# EAGLE design PIC28 (EAGLE 5.12)
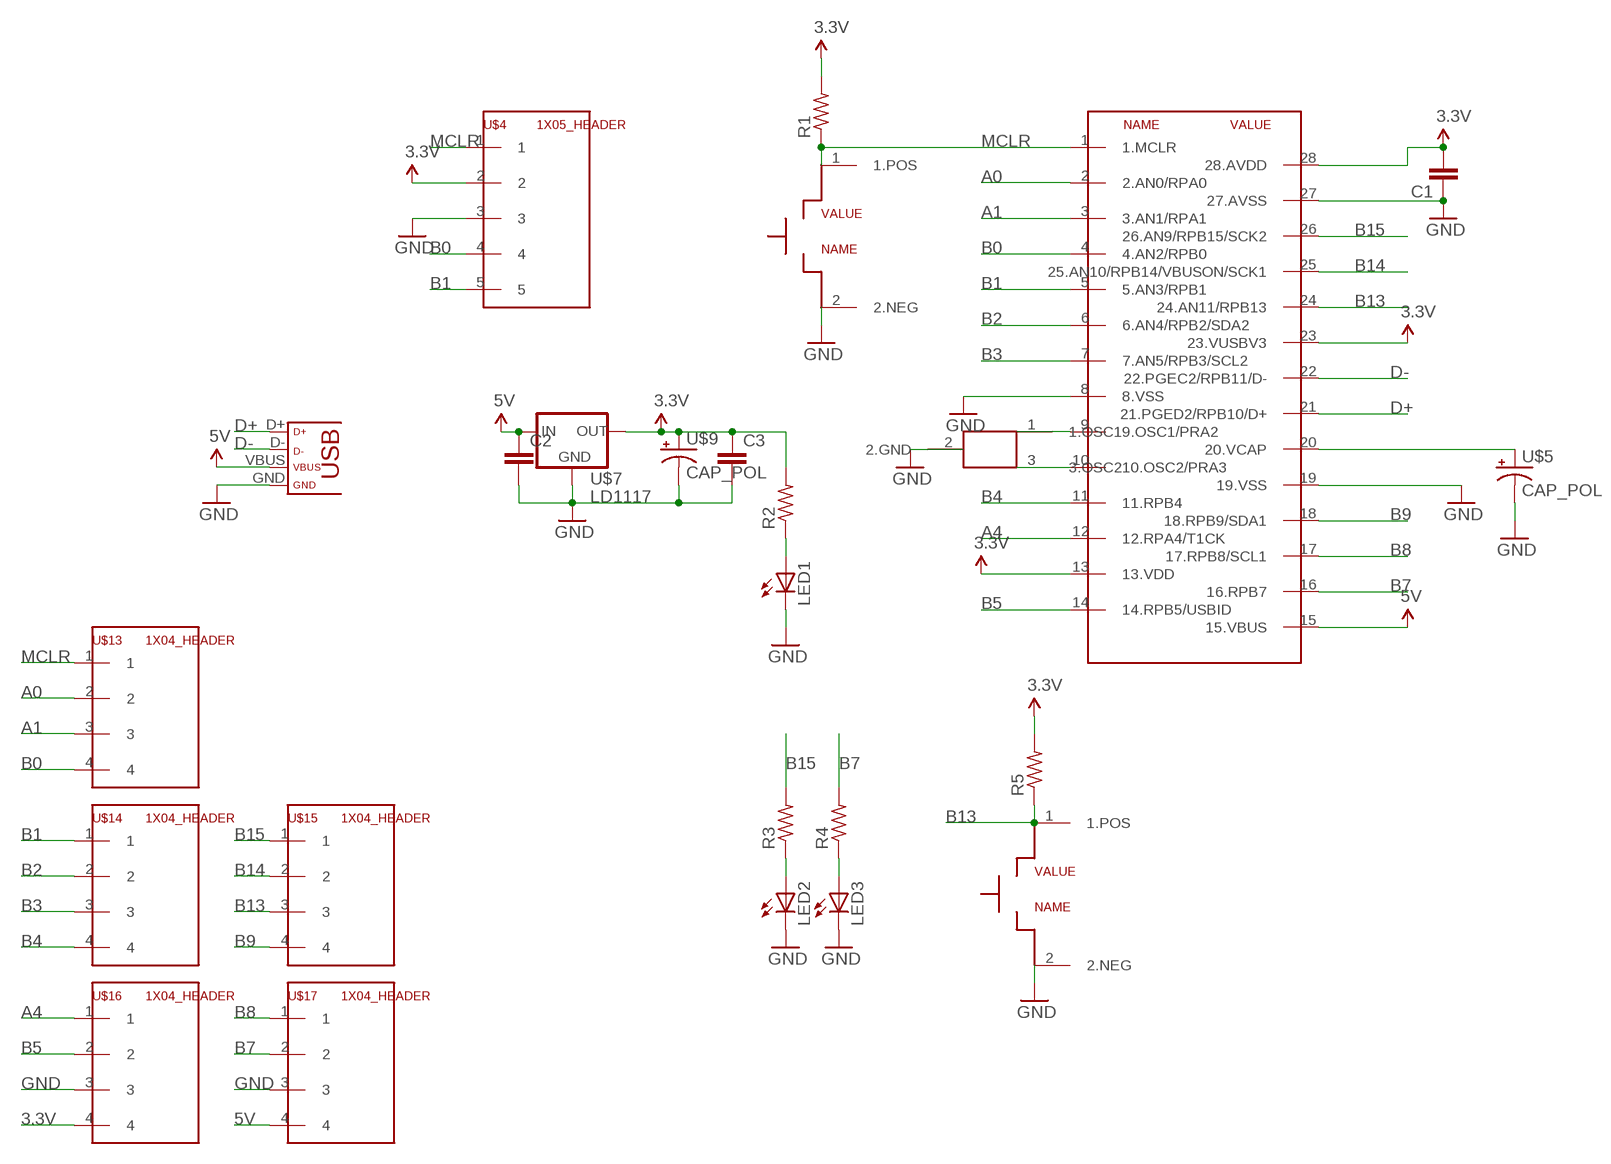
[diagram p0: schematic, sheet 1]

## Parts
C1  C-EU025-025X050  [C025-025X050]
C2  C-EU025-025X050  [C025-025X050]
C3  C-EU025-025X050  [C025-025X050]
LED1  LED3MM  [LED3MM]
LED2  LED3MM  [LED3MM]
LED3  LED3MM  [LED3MM]
R1  R-US_0309/12  [0309/12]
R2  R-US_0309/12  [0309/12]
R3  R-US_0309/12  [0309/12]
R4  R-US_0309/12  [0309/12]
R5  R-US_0309/12  [0309/12]
U$1  PIC28  [DIL28-3]
U$2  BUTTON  [BUTTON]
U$3  RESONATOR  [1X03]
U$4  1X05_HEADER  [1X05]
U$5  CAP_POL  [CAP_POL_D]
U$7  LD1117  [TO220]
U$9  CAP_POL  [CAP_POL_D]
U$10  USB  [USB-MINIB]
U$12  BUTTON  [BUTTON]
U$13  1X04_HEADER  [1X04]
U$14  1X04_HEADER  [1X04]
U$15  1X04_HEADER  [1X04]
U$16  1X04_HEADER  [1X04]
U$17  1X04_HEADER  [1X04]

## Nets
3.3V: C1.2 C3.1 R1.2 R2.2 R5.2 U$1.13(13.VDD) U$1.23(23.VUSBV3) U$1.28(28.AVDD) U$4.2 U$7.2(OUT) U$9.1(+) U$16.4
5V: C2.1 U$1.15(15.VBUS) U$7.3(IN) U$10.VBUS U$17.4
A0: U$1.2(2.AN0/RPA0) U$13.2
A1: U$1.3(3.AN1/RPA1) U$13.3
A4: U$1.12(12.RPA4/T1CK) U$16.1
B0: U$1.4(4.AN2/RPB0) U$4.4 U$13.4
B1: U$1.5(5.AN3/RPB1) U$4.5 U$14.1
B2: U$1.6(6.AN4/RPB2/SDA2) U$14.2
B3: U$1.7(7.AN5/RPB3/SCL2) U$14.3
B4: U$1.11(11.RPB4) U$14.4
B5: U$1.14(14.RPB5/USBID) U$16.2
B7: R4.2 U$1.16(16.RPB7) U$17.2
B8: U$1.17(17.RPB8/SCL1) U$17.1
B9: U$1.18(18.RPB9/SDA1) U$15.4
B13: R5.1 U$1.24(24.AN11/RPB13) U$12.1(1.POS) U$15.3
B14: U$1.25(25.AN10/RPB14/VBUSON/SCK1) U$15.2
B15: R3.2 U$1.26(26.AN9/RPB15/SCK2) U$15.1
D+: U$1.21(21.PGED2/RPB10/D+) U$10.D+
D-: U$1.22(22.PGEC2/RPB11/D-) U$10.D-
GND: C1.1 C2.2 C3.2 LED1.K(C) LED2.K(C) LED3.K(C) U$1.8(8.VSS) U$1.19(19.VSS) U$1.27(27.AVSS) U$2.2(2.NEG) U$3.2(2.GND) U$4.3 U$5.2(-) U$7.1(GND) U$9.2(-) U$10.GND U$12.2(2.NEG) U$16.3 U$17.3
MCLR: R1.1 U$1.1(1.MCLR) U$2.1(1.POS) U$4.1 U$13.1
N$1: LED1.A R2.1
N$4: LED2.A R3.1
N$5: LED3.A R4.1
N$7: U$1.20(20.VCAP) U$5.1(+)
N$8: U$1.9(9.OSC1/PRA2) U$3.1(1.OSC1)
N$9: U$1.10(10.OSC2/PRA3) U$3.3(3.OSC2)

## Library data of the parts
C1-C3 = ME433:C-EU: CAPACITOR, European symbol
LED1-LED3 = ME433:LED: LED OSRAM: - CHIPLED LG R971, LG N971, LY N971, LG Q971, LY Q971, LO R971, LY R971 LH N974, LH R974 LS Q976, LO Q976, LY Q976 LO Q996 - Hyper CHIPLED LW Q18S LB Q993, LB Q99A, LB R99A - SideLED LS A670, LO A670, LY A670, LG A670, LP A670 LB A673, LV A673, LT A673, LW A673 LH A674 LY A675 LS A676, LA A676, LO A676, LY A676, LW A676 LS A679, LY A679, LG A679 - Hyper Micro SIDELED® LS Y876, LA Y876, LO Y876, LY Y876 LT Y87S - SmartLED LW L88C, LW L88S LB L89C, LB L89S, LG L890 LS L89K, LO L89K, LY L89K LS L896, LA L896, LO L896, LY L896 - TOPLED LS T670, LO T670, LY T670, LG T670, LP T670 LSG T670, LSP T670, LSY T670, LOP T670, LYG T670 LG T671, LOG T671, LSG T671 LB T673, LV T673, LT T673, LW T673 LH T674 LS T676, LA T676, LO T676, LY T676, LB T676, LH T676, LSB T676, LW T676 LB T67C, LV T67C, LT T67C, LS T67K, LO T67K, LY T67K, LW E67C LS E67B, LA E67B, LO E67B, LY E67B, LB E67C, LV E67C, LT E67C LW T67C LS T679, LY T679, LG T679 LS T770, LO T770, LY T770, LG T770, LP T770 LB T773, LV T773, LT T773, LW T773 LH T774 LS E675, LA E675, LY E675, LS T675 LS T776, LA T776, LO T776, LY T776, LB T776 LHGB T686 LT T68C, LB T68C - Hyper Mini TOPLED® LB M676 - Mini TOPLED Santana® LG M470 LS M47K, LO M47K, LY M47K Source: http://www.osram.convergy.de LUXEON: - LUMILED® LXK2-PW12-R00, LXK2-PW12-S00, LXK2-PW14-U00, LXK2-PW14-V00 LXK2-PM12-R00, LXK2-PM12-S00, LXK2-PM14-U00 LXK2-PE12-Q00, LXK2-PE12-R00, LXK2-PE12-S00, LXK2-PE14-T00, LXK2-PE14-U00 LXK2-PB12-K00, LXK2-PB12-L00, LXK2-PB12-M00, LXK2-PB14-N00, LXK2-PB14-P00, LXK2-PB14-Q00 LXK2-PR12-L00, LXK2-PR12-M00, LXK2-PR14-Q00, LXK2-PR14-R00 LXK2-PD12-Q00, LXK2-PD12-R00, LXK2-PD12-S00 LXK2-PH12-R00, LXK2-PH12-S00 LXK2-PL12-P00, LXK2-PL12-Q00, LXK2-PL12-R00 Source: www.luxeon.com KINGBRIGHT: KA-3528ASYC Source: www.kingbright.com
R1-R5 = ME433:R-US_: RESISTOR, American symbol
U$1 = ME433:PIC28
U$2 U$12 = ME433:BUTTON
U$3 = ME433:RESONATOR
U$4 = ME433:1X05_HEADER
U$5 U$9 = ME433:CAP_POL
U$7 = ME433:LD1117
U$10 = ME433:USB
U$13-U$17 = ME433:1X04_HEADER

## Board
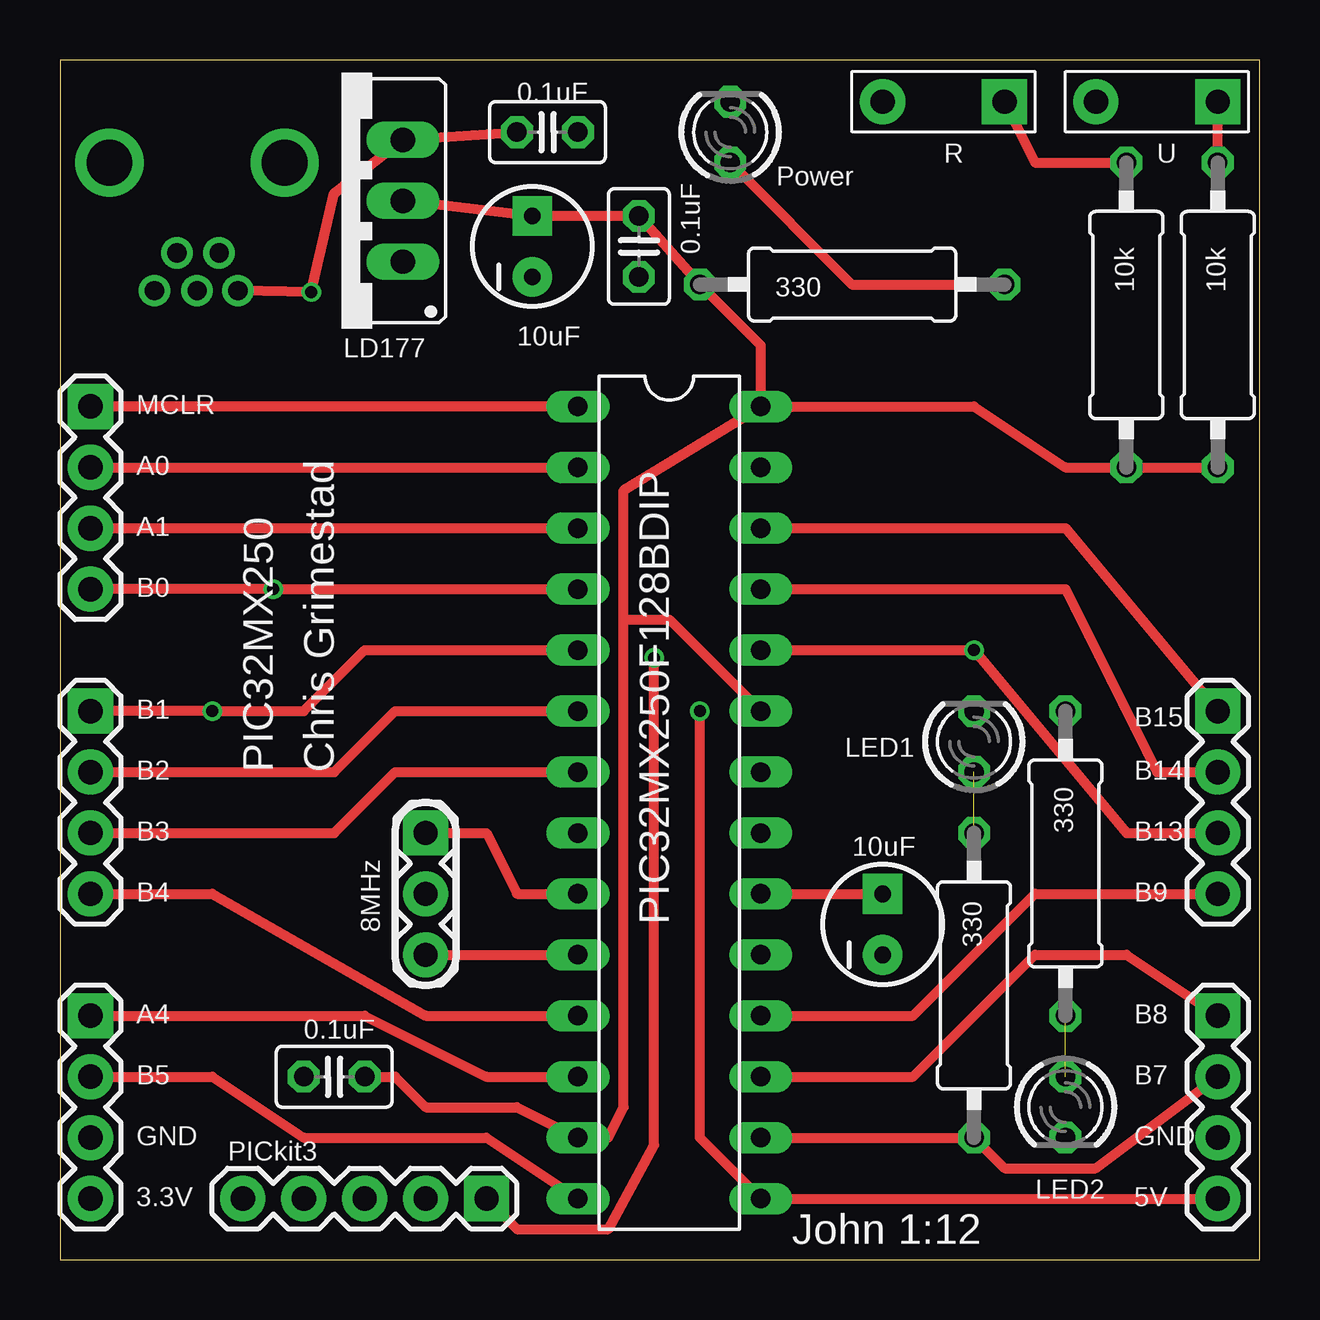
[diagram p1: board, top side]
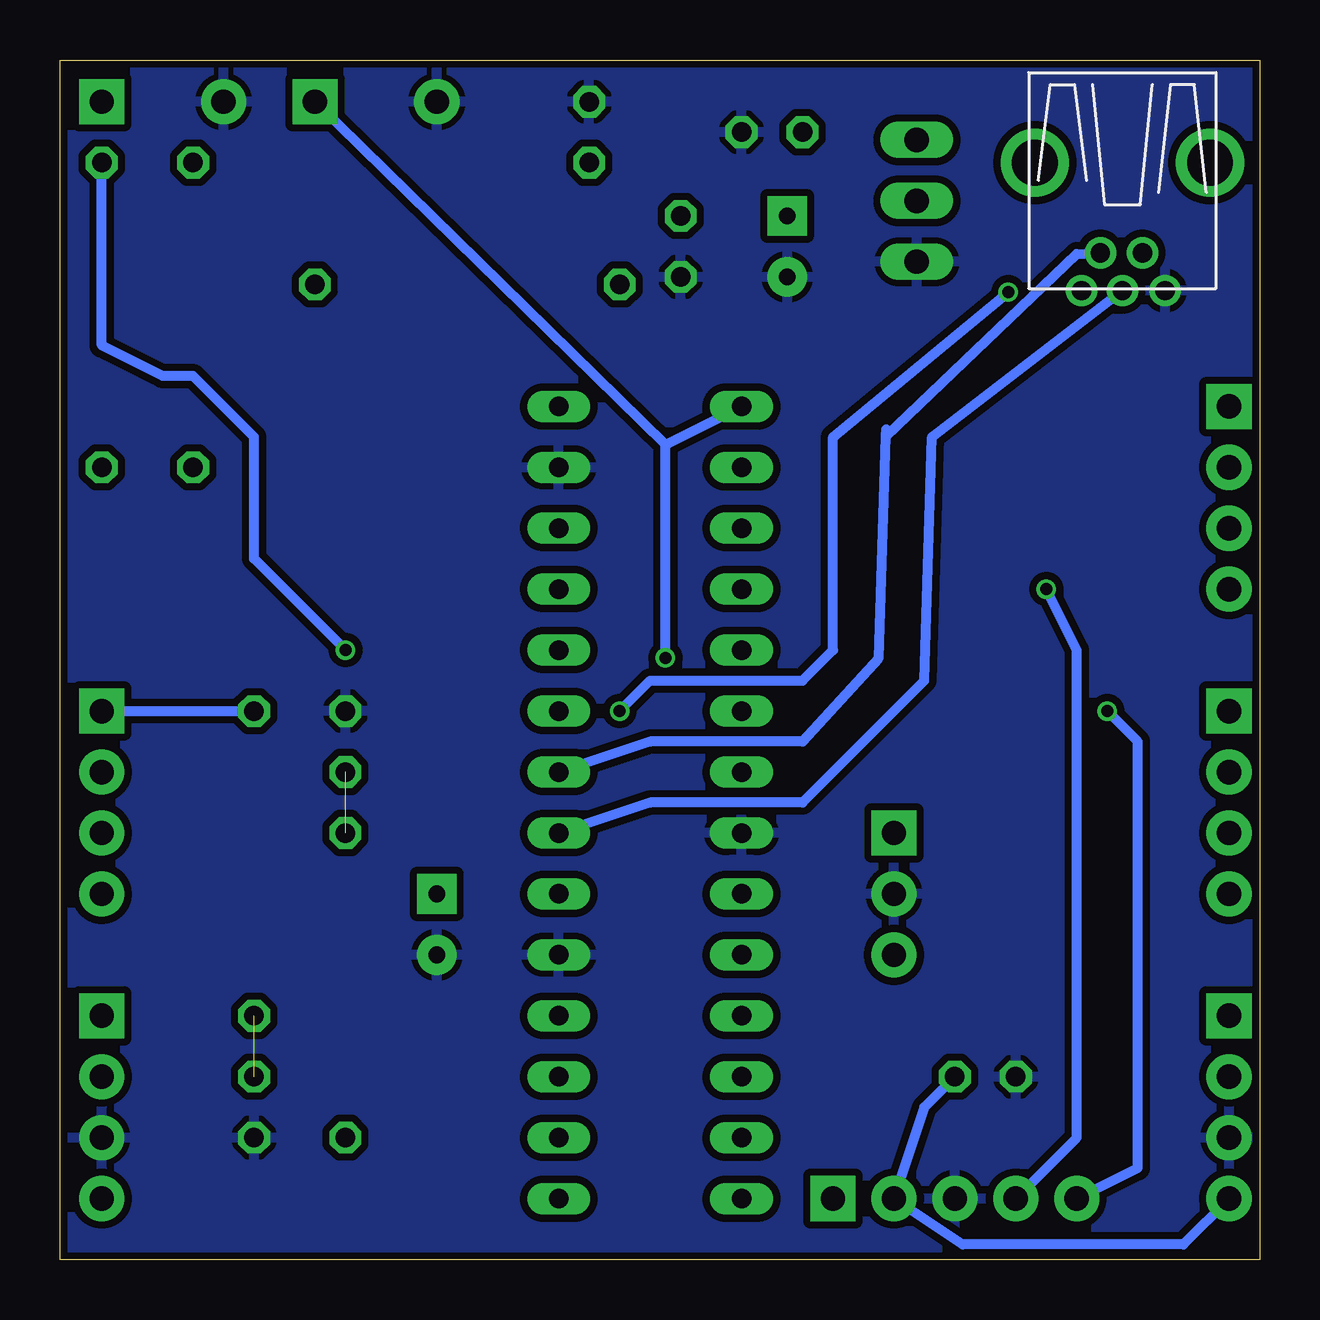
[diagram p2: board, bottom side, seen from below]

Size 50 x 50 mm. Coordinates in mm from the lower left corner, seen from the top.
Outline: 0,0 50,0 50,50 0,50 0,0
Copper layers (1*16): Top 0.035mm / dielectric 1.5mm / Bottom 0.035mm
Design rules "SeeedStudio_2layer_DRU_no_angle_20140221": minimum track width 6mil, minimum drill 12mil, track to track 6mil, track to pad 6mil, pad to pad 6mil, via to via 6mil, smd to smd 0mil, copper to edge 10mil, drill to drill 10mil, minimum pad ring 10mil, minimum via ring 6mil, stop-mask expansion 2mil, vias tented up to drill 100mil, thermal gap 10mil

### Footprints (pad centres in the part's own frame; a part is rotated, then mirrored left to right if it is on the bottom)
C025-025X050 = drill 0.813 octagon: 1 -1.27,0; 2 1.27,0
LED3MM = drill 0.813 octagon: A -1.27,0; K 1.27,0
0309/12 = drill 0.813 octagon: 1 -6.35,0; 2 6.35,0
DIL28-3 = drill 0.813 long: 1 -16.51,-3.81; 2 -13.97,-3.81; 3 -11.43,-3.81; 4 -8.89,-3.81; 5 -6.35,-3.81; 6 -3.81,-3.81; 7 -1.27,-3.81; 8 1.27,-3.81; 9 3.81,-3.81; 10 6.35,-3.81; 11 8.89,-3.81; 12 11.43,-3.81; 13 13.97,-3.81; 14 16.51,-3.81; 15 16.51,3.81; 16 13.97,3.81; 17 11.43,3.81; 18 8.89,3.81; 19 6.35,3.81; 20 3.81,3.81; 21 1.27,3.81; 22 -1.27,3.81; 23 -3.81,3.81; 24 -6.35,3.81; 25 -8.89,3.81; 26 -11.43,3.81; 27 -13.97,3.81; 28 -16.51,3.81
BUTTON = drill 1.016 pad 1.88 square: 1 -2.54,0 | drill 1.016 pad 1.88 round: 2 2.54,0
1X03 = drill 1.016 pad 1.88 square: 1 0,0 | drill 1.016 pad 1.88 round: 2 2.54,0; 3 5.08,0
1X05 = drill 1.016 pad 1.88 square: 1 0,0 | drill 1.016 pad 1.88 round: 2 2.54,0; 3 5.08,0; 4 7.62,0; 5 10.16,0
CAP_POL_D = drill 0.7 pad 1.651 square: 1 1.27,0 | drill 0.7 pad 1.651 round: 2 -1.27,0
TO220 = drill 1.016 long: 1 -2.54,0; 2 0,0; 3 2.54,0
USB-MINIB = drill 0.8 round: D+ 4.064,0; D- 2.489,0.914; GND 4.064,-1.778; ID 2.489,-0.838; VBUS 4.064,1.702 | drill 1.9 round: P$6 -1.27,-3.65; P$7 -1.27,3.65
1X04 = drill 1.016 pad 1.88 square: 1 0,0 | drill 1.016 pad 1.88 round: 2 2.54,0; 3 5.08,0; 4 7.62,0

### Placement (x,y rotation side)
C1  24.13,42.23 90 top
C2  20.32,46.99 0 top
C3  11.43,7.62 180 top
LED1  27.94,46.99 90 top
LED2  41.91,6.35 270 top
LED3  38.1,21.59 90 top
R1  44.45,39.37 270 top
R2  33.02,40.64 180 top
R3  41.91,16.51 90 top
R4  38.1,11.43 270 top
R5  48.26,39.37 270 top
U$1  25.4,19.05 270 top
U$2  36.83,48.26 180 top
U$3  15.24,17.78 270 top
U$4  17.78,2.54 180 top
U$5  34.29,13.97 90 top
U$7  14.29,44.13 90 top
U$9  19.68,42.23 90 top
U$10  5.71,44.45 270 top
U$12  45.72,48.26 180 top
U$13  1.27,35.56 270 top
U$14  1.27,22.86 270 top
U$15  48.26,22.86 270 top
U$16  1.27,10.16 270 top
U$17  48.26,10.16 270 top

### Tracks (layer width: path | path; a pad name or v marks a point on that pad's centre or on a via)
3.3V
  Top 0.406: C3.1 13.97,7.62 15.24,6.35 19.05,6.35 U$1.13 22.86,5.08 23.5,6.35 23.5,26.67 | 23.5,26.67 23.5,32.07 U$1.28 | U$1.23 25.4,26.67 23.5,26.67 | U$1.28 38.1,35.56 41.91,33.02 R1.2 R5.2 | U$1.28 29.21,38.1 R2.2 C1.2 U$9.1 U$7.2
  Bottom 0.406: C3.1 13.97,6.35 U$4.2 12.38,0.64 3.17,0.64 U$16.4
5V  (via drill 0.5)
  Top 0.406: U$10.VBUS v10.48,40.32 11.43,44.45 U$7.3 C2.1 | U$17.4 U$1.15 26.67,5.08 v26.67,22.86
  Bottom 0.406: v26.67,22.86 25.4,24.13 19.05,24.13 17.78,25.4 17.78,34.29 v10.48,40.32
A0
  Top 0.406: U$13.2 U$1.2
A1
  Top 0.406: U$13.3 U$1.3
A4
  Top 0.406: U$16.1 12.7,10.16 17.78,7.62 U$1.12
B0  (via drill 0.5)
  Top 0.406: U$13.4 v8.89,27.94 U$1.4
  Bottom 0.406: U$4.4 7.62,5.08 7.62,25.4 v8.89,27.94
B1  (via drill 0.5)
  Top 0.406: U$14.1 v6.35,22.86 10.16,22.86 12.7,25.4 U$1.5
  Bottom 0.406: U$4.5 5.08,3.81 5.08,21.59 v6.35,22.86
B2
  Top 0.406: U$14.2 11.43,20.32 13.97,22.86 U$1.6
B3
  Top 0.406: U$14.3 11.43,17.78 13.97,20.32 U$1.7
B4
  Top 0.406: U$14.4 6.35,15.24 15.24,10.16 U$1.11
B5
  Top 0.406: U$16.2 6.35,7.62 10.16,5.08 17.78,5.08 U$1.14
B7
  Top 0.406: U$1.16 R4.2 39.37,3.81 43.18,3.81 U$17.2
B8
  Top 0.406: U$1.17 35.56,7.62 40.64,12.7 44.45,12.7 U$17.1
B9
  Top 0.406: U$1.18 35.56,10.16 40.64,15.24 U$15.4
B13  (via drill 0.5)
  Top 0.406: R5.1 U$12.1 | U$1.24 v38.1,25.4 44.45,17.78 U$15.3
  Bottom 0.406: R5.1 48.26,38.1 45.72,36.83 44.45,36.83 41.91,34.29 41.91,29.21 v38.1,25.4
B14
  Top 0.406: U$1.25 41.91,27.94 45.72,20.32 U$15.2
B15
  Top 0.406: U$1.26 41.91,30.48 U$15.1
  Bottom 0.406: U$15.1 R3.2
D+
  Bottom 0.406: U$10.D+ 13.65,34.29 13.97,24.13 19.05,19.05 25.4,19.05 U$1.21
D-
  Bottom 0.406: 15.57,34.3 15.88,25.08 19.05,21.59 25.4,21.59 U$1.22 | 15.57,34.3 15.56,34.61 | U$10.D- 7.62,41.91 15.57,34.3
GND
  pour Bottom (isolate 0.305): 0,49.53 0,0 49.53,0 49.53,49.53
MCLR  (via drill 0.5)
  Top 0.406: U$1.1 U$13.1 | U$4.1 19.05,1.27 22.86,1.27 24.77,4.76 v24.77,25.08 | U$2.1 40.64,45.72 R1.1
  Bottom 0.406: v24.77,25.08 24.77,33.97 | 24.77,33.97 U$2.1 | 24.77,33.97 U$1.1
N$1
  Top 0.406: LED1.A 33.02,40.64 R2.1
N$4  (1 unrouted)
N$5  (1 unrouted)
N$7
  Top 0.406: U$1.20 U$5.1
N$8
  Top 0.406: U$3.1 17.78,17.78 19.05,15.24 U$1.9
N$9
  Top 0.406: U$3.3 U$1.10

### Text on the board
tPlace: 0.1uF | R | U | Power | 0.1uF | 330 | 10k | 10k | LD177 | 10uF | MCLR | A0 | A1 | B0 | B1 | B15 | LED1 | B2 | PIC32MX250 | Chris Grimestad | B14 | 330 | B3 | 10uF | B13 | B4 | B9 | 8MHz | PIC32MX250F128BDIP | 330 | A4 | B8 | 0.1uF | B5 | B7 | GND | GND | PICkit3 | LED2 | 3.3V | John 1:12 | 5V